# EAGLE design D1MiniRFM95 (EAGLE 8.2.1)
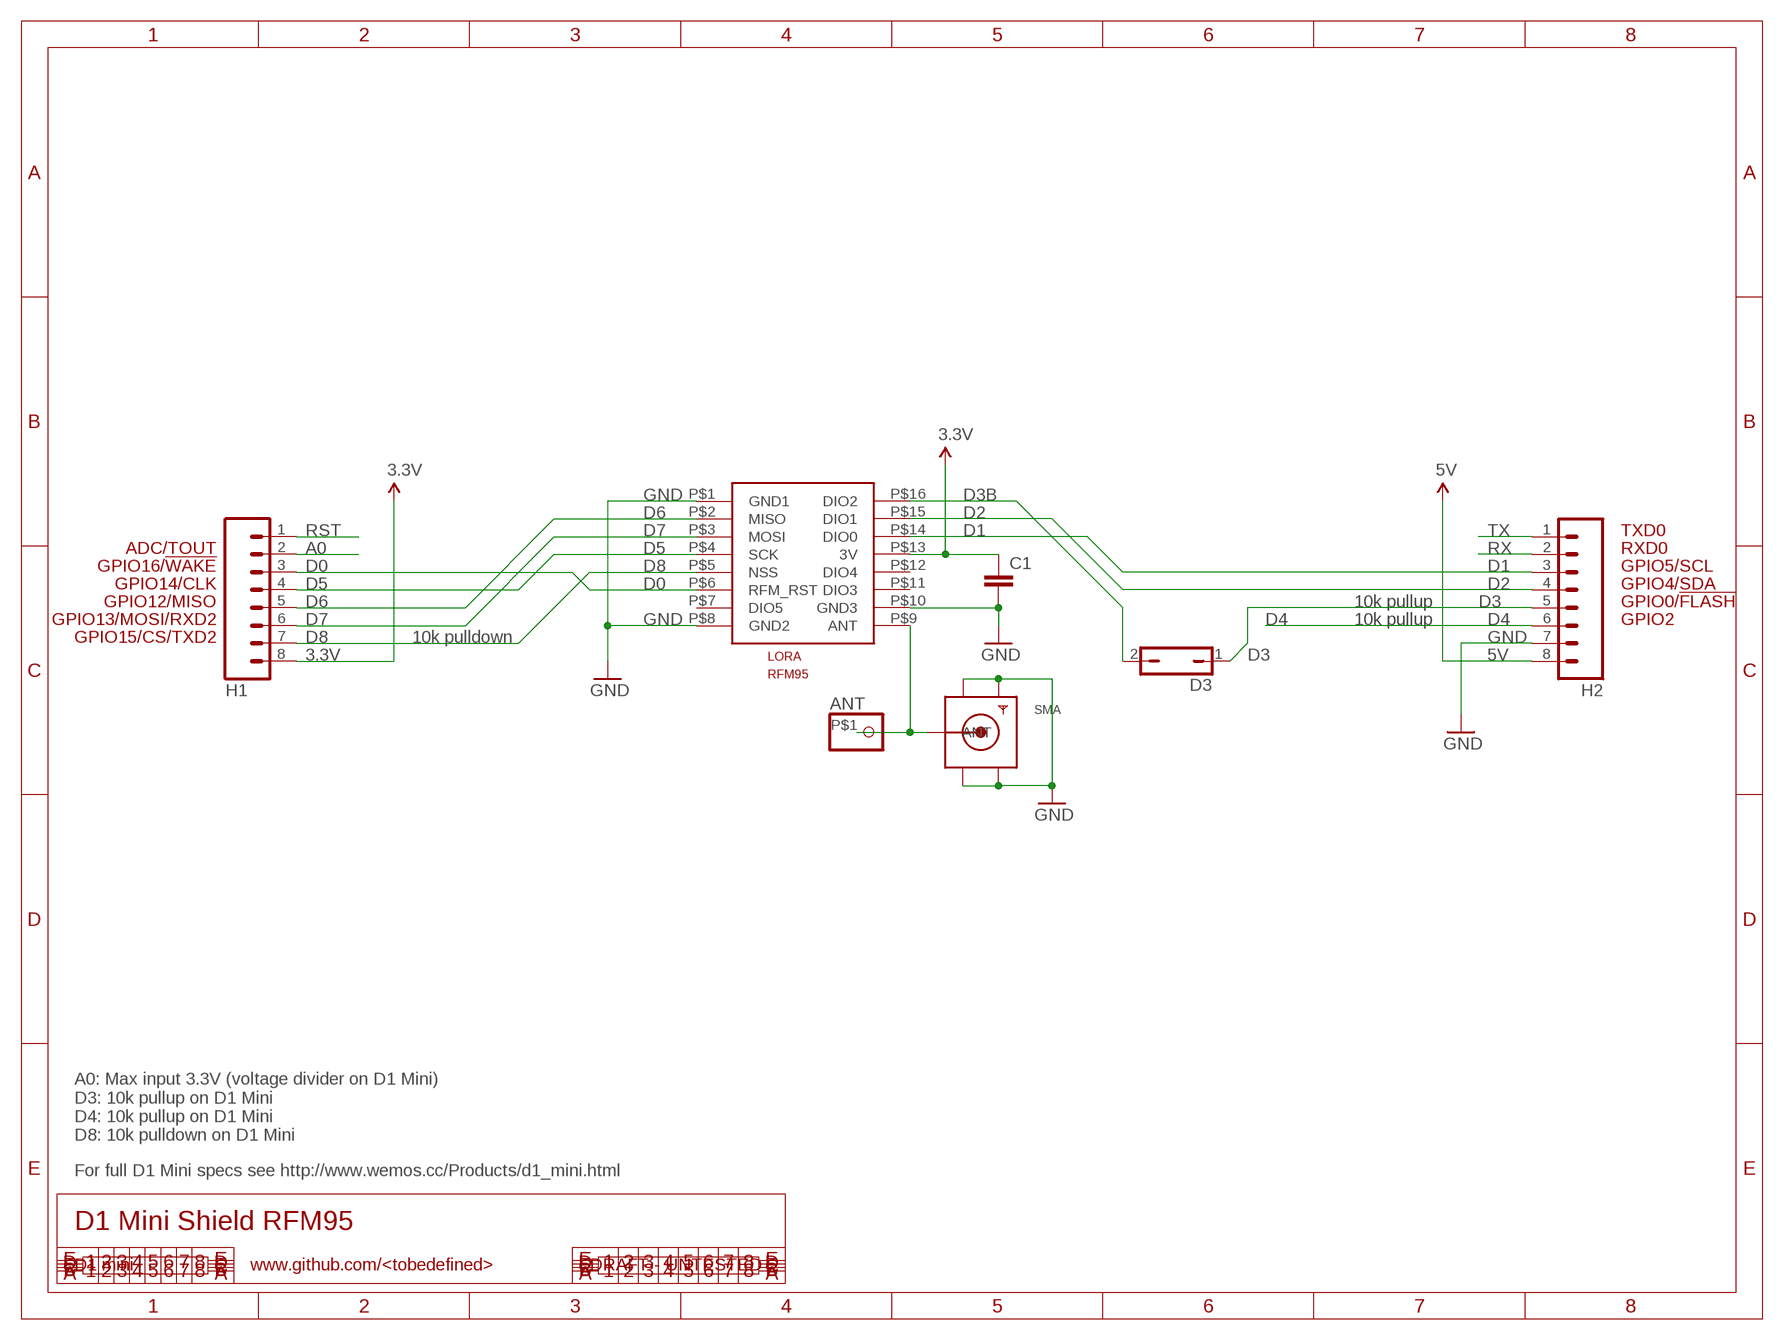
[diagram p0: schematic, sheet 1]

## Parts
ANT  PINHD-1X1-BIGPOGO  [1X1-BIGPOGO]
C1  C-EU025-024X044  [C025-024X044]
D3  JP1Q  [JP1]
H1  M08  [1X08]
H2  M08  [1X08]
LORA  RFM95  [RFM95]
SMA  SMACONNECTOR_EDGE  [SMA_EDGELAUNCH]

## Nets
3.3V: C1.1 H1.8 LORA.P$13(3V)
5V: H2.8
A0: H1.2
ANT: ANT.P$1 LORA.P$9(ANT) SMA.P(ANT)
D0: H1.3 LORA.P$6(RFM_RST)
D1: H2.3 LORA.P$14(DIO0)
D2: H2.4 LORA.P$15(DIO1)
D3: D3.1 H2.5
D3B: D3.2 LORA.P$16(DIO2)
D4: H2.6
D5: H1.4 LORA.P$4(SCK)
D6: H1.5 LORA.P$2(MISO)
D7: H1.6 LORA.P$3(MOSI)
D8: H1.7 LORA.P$5(NSS)
GND: C1.2 H2.7 LORA.P$1(GND1) LORA.P$8(GND2) LORA.P$10(GND3) SMA.GND@1(GND4) SMA.GND@2(GND3) SMA.GND@3(GND2) SMA.GND@4(GND1)
RST: H1.1
RX: H2.2
TX: H2.1
Unconnected: LORA.P$7(DIO5) LORA.P$11(DIO3) LORA.P$12(DIO4)

## Notes on the sheet
- TXD0
- ADC/TOUT | RXD0
- GPIO16/!WAKE | GPIO5/SCL
- GPIO14/CLK | GPIO4/SDA
- GPIO12/MISO | 10k pullup | GPIO0/!FLASH
- GPIO13/MOSI/RXD2 | 10k pullup | GPIO2
- GPIO15/CS/TXD2 | 10k pulldown
- A0: Max input 3.3V (voltage divider on D1 Mini)
  D3: 10k pullup on D1 Mini
  D4: 10k pullup on D1 Mini
  D8: 10k pulldown on D1 Mini
- For full D1 Mini specs see http://www.wemos.cc/Products/d1_mini.html
- D1 Mini Shield RFM95
- D1 mini | www.github.com/<tobedefined> | DRAFT - UNTESTED

## Library data of the parts
ANT = adafruit:PINHD-1X1: Pin header 1x1 for 0.1" spacing With round pins
C1 = resistor:C-EU: CAPACITOR, European symbol
D3 = jumper:JP1Q: JUMPER
H1 H2 = freetronics-original:M08: Header 8 Standard 8-pin 0.1" header. Use with straight break away headers (SKU : PRT-00116), right angle break away headers (PRT-00553), swiss pins (PRT-00743), machine pins (PRT-00117), and female headers (PRT-00115).
LORA = my lib:RFM95: RFM95 module; DESC: lora rfm95
SMA = adafruit:SMACONNECTOR: SMA Connector 90° DIP SMA Connector, 50 Ohm (4UConnector: 07259)

## Net classes
0 default: width 0.203 mm, drill 0.356 mm, clearance 0.152 mm
1 power: width 0.203 mm, clearance 0.152 mm

## Board
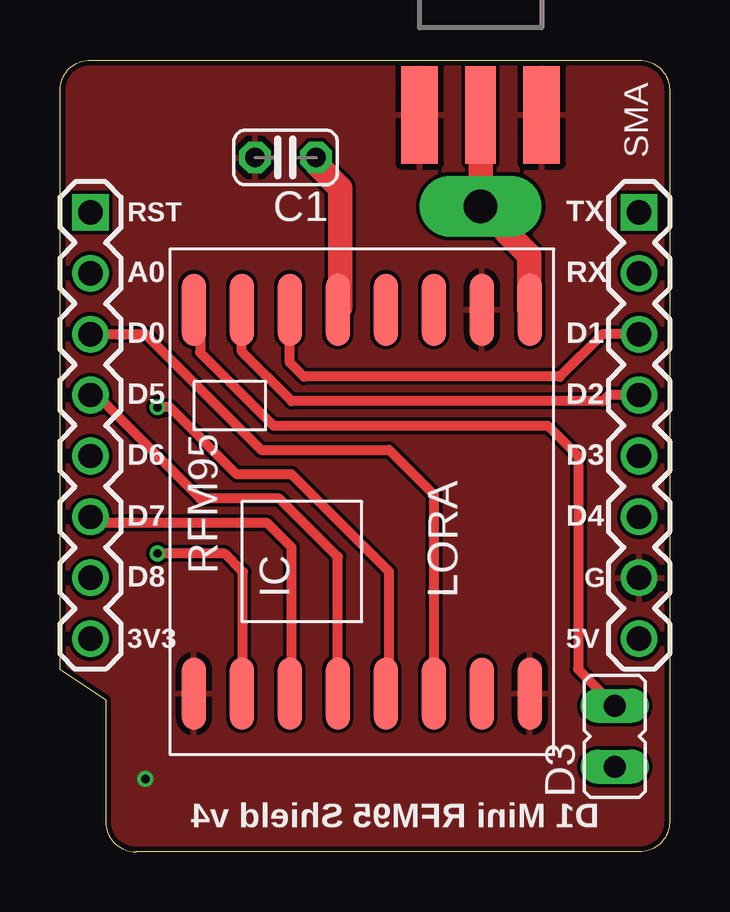
[diagram p1: board, top side]
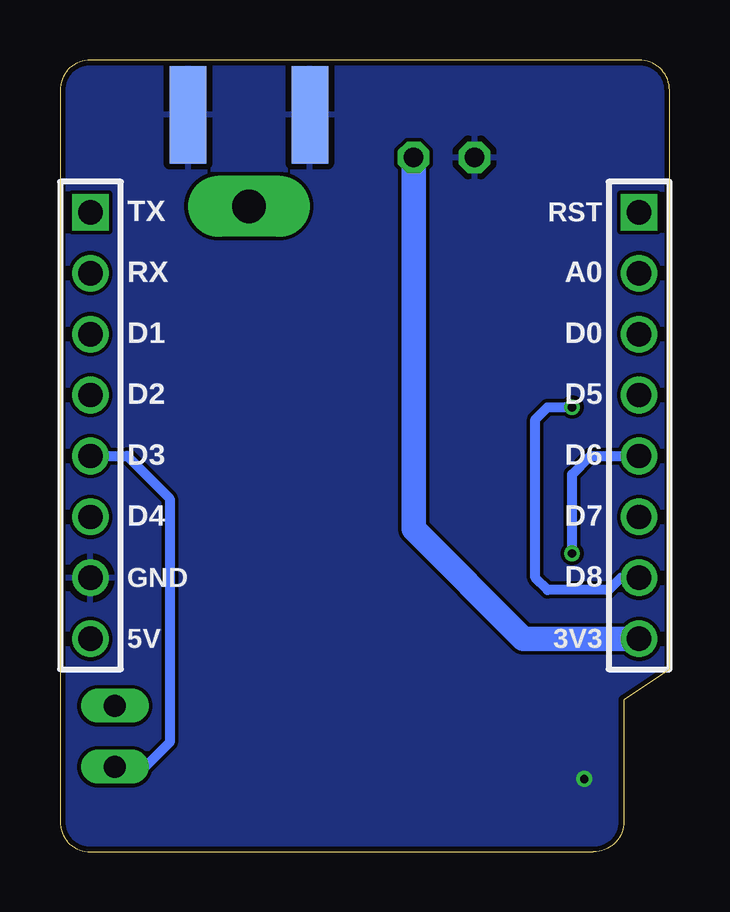
[diagram p2: board, bottom side, seen from below]

Size 25.4 x 33.02 mm. Coordinates in mm from the lower left corner, seen from the top.
Outline: 25.4,31.75 25.4,1.27 arc-90 24.13,0 3.17,0 arc-90 1.91,1.27 1.91,6.35 0,7.62 0,31.75 arc-90 1.27,33.02 24.13,33.02 arc-90 25.4,31.75
Copper layers (1*16): Top 0.035mm / dielectric 1.5mm / Bottom 0.035mm
Design rules "ElectroDragon_2layer_DRU_no_angle_20140221": minimum track width 6mil, minimum drill 12mil, track to track 6mil, track to pad 6mil, pad to pad 6mil, via to via 6mil, smd to smd 6mil, copper to edge 8mil, drill to drill 6mil, minimum pad ring 10mil, minimum via ring 6mil, stop-mask expansion 4mil, vias tented up to drill 100mil, thermal gap 10mil

### Footprints (pad centres in the part's own frame; a part is rotated, then mirrored left to right if it is on the bottom)
1X1-BIGPOGO = drill 1.4 pad 2.54 long: P$1 0,0
C025-024X044 = drill 0.813 octagon: 1 -1.27,0; 2 1.27,0
JP1 = drill 0.914 long: 1 0,-1.27; 2 0,1.27
1X08 = drill 1.016 square: 1 0,0 | drill 1.016: 2 2.54,0; 3 5.08,0; 4 7.62,0; 5 10.16,0; 6 12.7,0; 7 15.24,0; 8 17.78,0
RFM95 = smd 3 x 1: P$1 0,15; P$2 0,13; P$3 0,11; P$4 0,9; P$5 0,7; P$6 0,5; P$7 0,3; P$8 0,1; P$9 16,1; P$10 16,3; P$11 16,5; P$12 16,7; P$13 16,9; P$14 16,11; P$15 16,13; P$16 16,15
SMA_EDGELAUNCH = smd 4.064 x 1.524: GND@1 2.032,-2.54; GND@2 2.032,2.54 | smd 4.064 x 1.524 bottom: GND@3 2.032,2.54; GND@4 2.032,-2.54 | smd 4.064 x 1.27: P 2.032,0

### Placement (x,y rotation side)
ANT  17.53,26.92 0 top
C1  9.4,28.96 180 top
D3  23.11,4.83 0 top
H1  1.27,26.67 270 top
H2  24.13,26.67 270 top
LORA  20.57,6.6 90 top
SMA  17.53,32.77 270 top

### Tracks (layer width: path | path; a pad name or v marks a point on that pad's centre or on a via)
3.3V
  Top 1.016: LORA.P$13 11.68,22.71 11.68,27.69 10.67,28.7 C1.1
  Bottom 1.016: H1.8 6.1,8.89 10.67,13.46 C1.1
ANT
  Top 1.016: SMA.P ANT.P$1 19.56,24.89 19.56,22.62 LORA.P$9
D0
  Top 0.406: LORA.P$6 15.57,14.91 13.72,16.76 8.38,16.76 3.56,21.59 H1.3
D1
  Top 0.406: H2.3 22.61,21.59 20.83,19.81 10.16,19.81 9.57,20.4 LORA.P$14
D2
  Top 0.406: H2.4 22.86,19.05 22.61,18.8 9.65,18.8 7.57,20.87 LORA.P$15
D3
  Bottom 0.406: H2.5 22.61,16.51 20.83,14.73 20.83,4.57 21.84,3.56 D3.1
D3B
  Top 0.406: LORA.P$16 5.84,22.34 5.84,20.83 8.89,17.78 20.32,17.78 21.59,16.51 21.59,7.62 D3.2
D5
  Top 0.406: LORA.P$4 11.57,12.3 9.14,14.73 5.84,14.73 1.52,19.05 H1.4
D6  (via drill 0.35)
  Top 0.406: LORA.P$2 7.62,6.56 7.62,11.68 6.86,12.45 v4.06,12.45
  Bottom 0.406: H1.5 3.3,16.51 4.06,15.75 v4.06,12.45
D7
  Top 0.406: LORA.P$3 9.65,6.68 9.65,12.7 8.64,13.72 1.52,13.72 H1.6
D8  (via drill 0.35)
  Top 0.406: LORA.P$5 13.72,6.46 13.72,11.68 9.65,15.75 7.37,15.75 4.57,18.54 v4.06,18.54
  Bottom 0.406: H1.7 2.03,11.43 2.54,10.92 5.08,10.92 5.59,11.43 5.59,18.03 5.08,18.54 v4.06,18.54
GND  (via drill 0.35)
  other vias: 3.56,3.05
  pour Top: 25.4,31.75 arc90 24.13,33.02 1.27,33.02 arc90 0,31.75 0,7.62 1.91,6.35 1.91,1.27 arc90 3.17,0 24.13,0 arc90 25.4,1.27
  pour Bottom: 25.4,1.27 25.4,31.75 arc90 24.13,33.02 1.27,33.02 arc90 0,31.75 0,7.62 1.91,6.35 1.91,1.27 arc90 3.17,0 24.13,0 arc90

### Text on the board
tPlace: RST | TX | A0 | RX | D0 | D1 | D5 | D2 | D6 | D3 | D7 | D4 | D8 | G | 3V3 | 5V
bPlace: RST | TX | A0 | RX | D0 | D1 | D5 | D2 | D6 | D3 | D7 | D4 | D8 | GND | 3V3 | 5V
tNames: D1 Mini RFM95 Shield v4